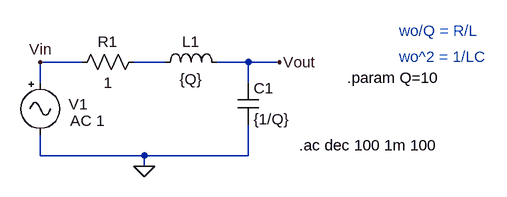
[diagram p0: schematic lrc.asc]
lrc.asc, the LTspice schematic file:
Version 4
SHEET 1 880 680
WIRE 48 128 -16 128
WIRE 176 128 128 128
WIRE 304 128 256 128
WIRE 352 128 304 128
WIRE -16 160 -16 128
WIRE 304 160 304 128
WIRE -16 272 -16 240
WIRE 144 272 -16 272
WIRE 304 272 304 224
WIRE 304 272 144 272
WIRE 144 288 144 272
FLAG 144 288 0
FLAG 352 128 Vout
FLAG -16 128 Vin
SYMBOL ind 160 144 R270
WINDOW 0 32 56 VTop 2
WINDOW 3 5 56 VBottom 2
SYMATTR InstName L1
SYMATTR Value {Q}
SYMBOL res 144 112 R90
WINDOW 0 0 56 VBottom 2
WINDOW 3 32 56 VTop 2
SYMATTR InstName R1
SYMATTR Value 1
SYMBOL cap 288 160 R0
SYMATTR InstName C1
SYMATTR Value {1/Q}
SYMBOL Misc\\signal -16 144 R0
WINDOW 0 44 49 Left 2
WINDOW 3 38 90 Left 2
WINDOW 123 46 74 Left 2
WINDOW 39 0 0 Left 0
SYMATTR InstName V1
SYMATTR Value ""
SYMATTR Value2 AC 1
TEXT 382 256 Left 2 !.ac dec 100 1m 100
TEXT 536 80 Left 2 ;wo/Q = R/L
TEXT 536 120 Left 2 ;wo^2 = 1/LC
TEXT 456 152 Left 2 !.param Q=10

The netlist it stands for:
* lrc.asc
L1 N001 Vout {Q}
R1 N001 Vin 1
C1 Vout 0 {1/Q}
V1 Vin 0 AC 1
.ac dec 100 1m 100
* wo/Q = R/L
* wo^2 = 1/LC
.param Q=10
.backanno
.end